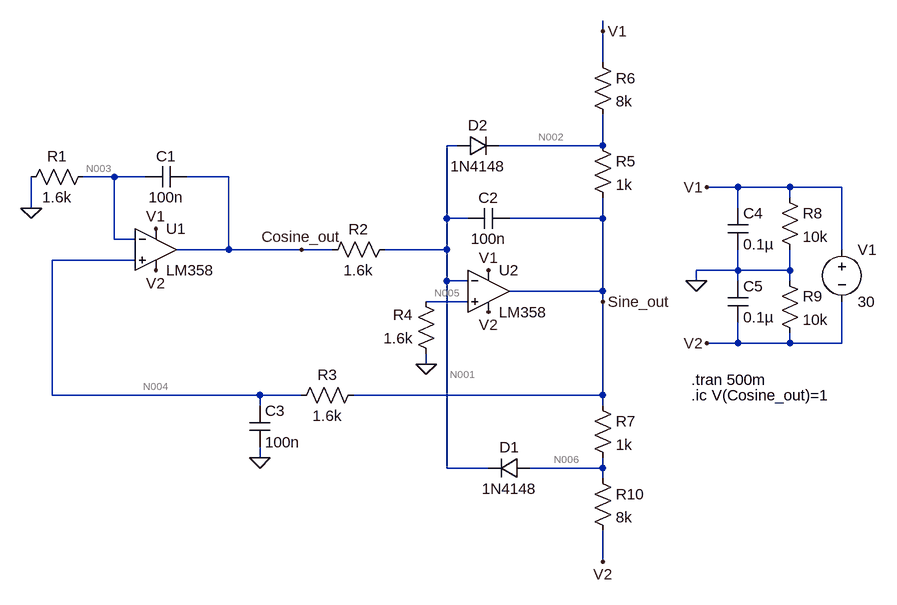
[diagram p0: schematic 1kHz sinecosine gen.asc]
1kHz sinecosine gen.asc, the LTspice schematic file:
Version 4
SHEET 1 1864 1124
WIRE 880 -128 880 -144
WIRE 880 -80 880 -128
WIRE 656 48 640 48
WIRE 880 48 880 0
WIRE 880 48 720 48
WIRE 128 96 80 96
WIRE 176 96 128 96
WIRE 304 96 240 96
WIRE 1088 112 1040 112
WIRE 1168 112 1088 112
WIRE 1248 112 1168 112
WIRE 1168 128 1168 112
WIRE 0 144 0 96
WIRE 1088 144 1088 112
WIRE 640 160 640 48
WIRE 672 160 640 160
WIRE 880 160 880 128
WIRE 880 160 736 160
WIRE 128 192 128 96
WIRE 160 192 128 192
WIRE 304 208 304 96
WIRE 304 208 224 208
WIRE 416 208 304 208
WIRE 464 208 416 208
WIRE 640 208 640 160
WIRE 640 208 544 208
WIRE 1248 208 1248 112
WIRE 160 224 32 224
WIRE 1088 240 1088 208
WIRE 1088 240 1024 240
WIRE 1168 240 1168 208
WIRE 1168 240 1088 240
WIRE 640 256 640 208
WIRE 672 256 640 256
WIRE 1024 256 1024 240
WIRE 1088 256 1088 240
WIRE 1168 256 1168 240
WIRE 880 272 880 160
WIRE 880 272 736 272
WIRE 672 288 608 288
WIRE 880 288 880 272
WIRE 1088 352 1088 320
WIRE 1088 352 1040 352
WIRE 1168 352 1168 336
WIRE 1168 352 1088 352
WIRE 1248 352 1248 288
WIRE 1248 352 1168 352
WIRE 608 384 608 368
WIRE 32 432 32 224
WIRE 352 432 32 432
WIRE 416 432 352 432
WIRE 880 432 880 288
WIRE 880 432 496 432
WIRE 352 448 352 432
WIRE 880 448 880 432
WIRE 352 528 352 512
WIRE 640 544 640 256
WIRE 704 544 640 544
WIRE 880 544 880 528
WIRE 880 544 768 544
WIRE 880 560 880 544
WIRE 880 688 880 640
FLAG 1040 352 V2
FLAG 192 240 V2
FLAG 1040 112 V1
FLAG 192 176 V1
FLAG 704 304 V2
FLAG 704 240 V1
FLAG 608 384 0
FLAG 0 144 0
FLAG 880 288 Sine_out
FLAG 416 208 Cosine_out
FLAG 1024 256 0
FLAG 352 528 0
FLAG 880 -128 V1
FLAG 880 688 V2
SYMBOL voltage 1248 192 R0
WINDOW 123 0 0 Left 0
WINDOW 39 0 0 Left 0
SYMATTR InstName V1
SYMATTR Value 30
SYMBOL ZZZ\\OpAmp\\LM358 192 208 R0
SYMATTR InstName U1
SYMBOL ZZZ\\OpAmp\\LM358 704 272 R0
SYMATTR InstName U2
SYMBOL cap 240 80 R90
WINDOW 0 0 32 VBottom 2
WINDOW 3 32 32 VTop 2
SYMATTR InstName C1
SYMATTR Value 100n
SYMBOL cap 672 176 R270
WINDOW 0 32 32 VTop 2
WINDOW 3 0 32 VBottom 2
SYMATTR InstName C2
SYMATTR Value 100n
SYMBOL res 96 80 R90
WINDOW 0 0 56 VBottom 2
WINDOW 3 32 56 VTop 2
SYMATTR InstName R1
SYMATTR Value 1.6k
SYMBOL res 560 192 R90
WINDOW 0 0 56 VBottom 2
WINDOW 3 32 56 VTop 2
SYMATTR InstName R2
SYMATTR Value 1.6k
SYMBOL res 624 384 R180
WINDOW 0 36 76 Left 2
WINDOW 3 36 40 Left 2
SYMATTR InstName R4
SYMATTR Value 1.6k
SYMBOL cap 336 448 R0
SYMATTR InstName C3
SYMATTR Value 100n
SYMBOL res 1152 112 R0
SYMATTR InstName R8
SYMATTR Value 10k
SYMBOL res 1152 240 R0
SYMATTR InstName R9
SYMATTR Value 10k
SYMBOL cap 1072 144 R0
SYMATTR InstName C4
SYMATTR Value 0.1µ
SYMBOL cap 1072 256 R0
SYMATTR InstName C5
SYMATTR Value 0.1µ
SYMBOL res 512 416 R90
WINDOW 0 0 56 VBottom 2
WINDOW 3 32 56 VTop 2
SYMATTR InstName R3
SYMATTR Value 1.6k
SYMBOL diode 768 528 R90
WINDOW 0 0 32 VBottom 2
WINDOW 3 32 32 VTop 2
SYMATTR InstName D1
SYMATTR Value 1N4148
SYMBOL diode 656 64 R270
WINDOW 0 32 32 VTop 2
WINDOW 3 0 32 VBottom 2
SYMATTR InstName D2
SYMATTR Value 1N4148
SYMBOL res 864 32 R0
SYMATTR InstName R5
SYMATTR Value 1k
SYMBOL res 864 -96 R0
SYMATTR InstName R6
SYMATTR Value 8k
SYMBOL res 864 432 R0
SYMATTR InstName R7
SYMATTR Value 1k
SYMBOL res 864 544 R0
SYMATTR InstName R10
SYMATTR Value 8k
TEXT 1016 408 Left 2 !.tran 500m
TEXT 1016 432 Left 2 !.ic V(Cosine_out)=1

The netlist it stands for:
* 1kHz sinecosine gen.asc
V1 V1 V2 30
XU1 N004 N003 V1 V2 Cosine_out LM358  ; pins In+ In- V+ V- OUT
XU2 N005 N001 V1 V2 Sine_out LM358  ; pins In+ In- V+ V- OUT
C1 Cosine_out N003 100n
C2 N001 Sine_out 100n
R1 N003 0 1.6k
R2 N001 Cosine_out 1.6k
R4 0 N005 1.6k
C3 N004 0 100n
R8 V1 0 10k
R9 0 V2 10k
C4 V1 0 0.1µ
C5 0 V2 0.1µ
R3 Sine_out N004 1.6k
D1 N006 N001 1N4148
D2 N001 N002 1N4148
R5 N002 Sine_out 1k
R6 V1 N002 8k
R7 Sine_out N006 1k
R10 N006 V2 8k
.model D D
.lib standard.dio
.tran 500m
.ic V(Cosine_out)=1
.backanno
.end

* Results of the author's LTspice run, read from the files saved beside the schematic
* Operating Point, zero values left out:
*   V(v1) = 29.12 V
*   V(v2) = -883.5 mV
*   V(n003) = 16.33 µV
*   V(cosine_out) = 1 V
*   V(n004) = 166.8 µV
*   V(n001) = 1 V
*   V(sine_out) = 151.4 µV
*   V(n005) = 62.36 µV
*   V(n006) = -98.03 mV
*   V(n002) = 3.235 V
*   I(D1) = -2.521 nA
*   I(D2) = -2.522 nA
*   I(R1) = 10.21 nA
*   I(R4) = -38.97 nA
*   I(R8) = 2.912 mA
*   I(R9) = 88.35 µA
*   I(R3) = -9.63 nA
*   I(R5) = 3.235 mA
*   I(R6) = 3.235 mA
*   I(R7) = 98.18 µA
*   I(R10) = 98.18 µA
*   I(V1) = -7.108 mA